# Altium schematic sheet right.SchDoc
size A1
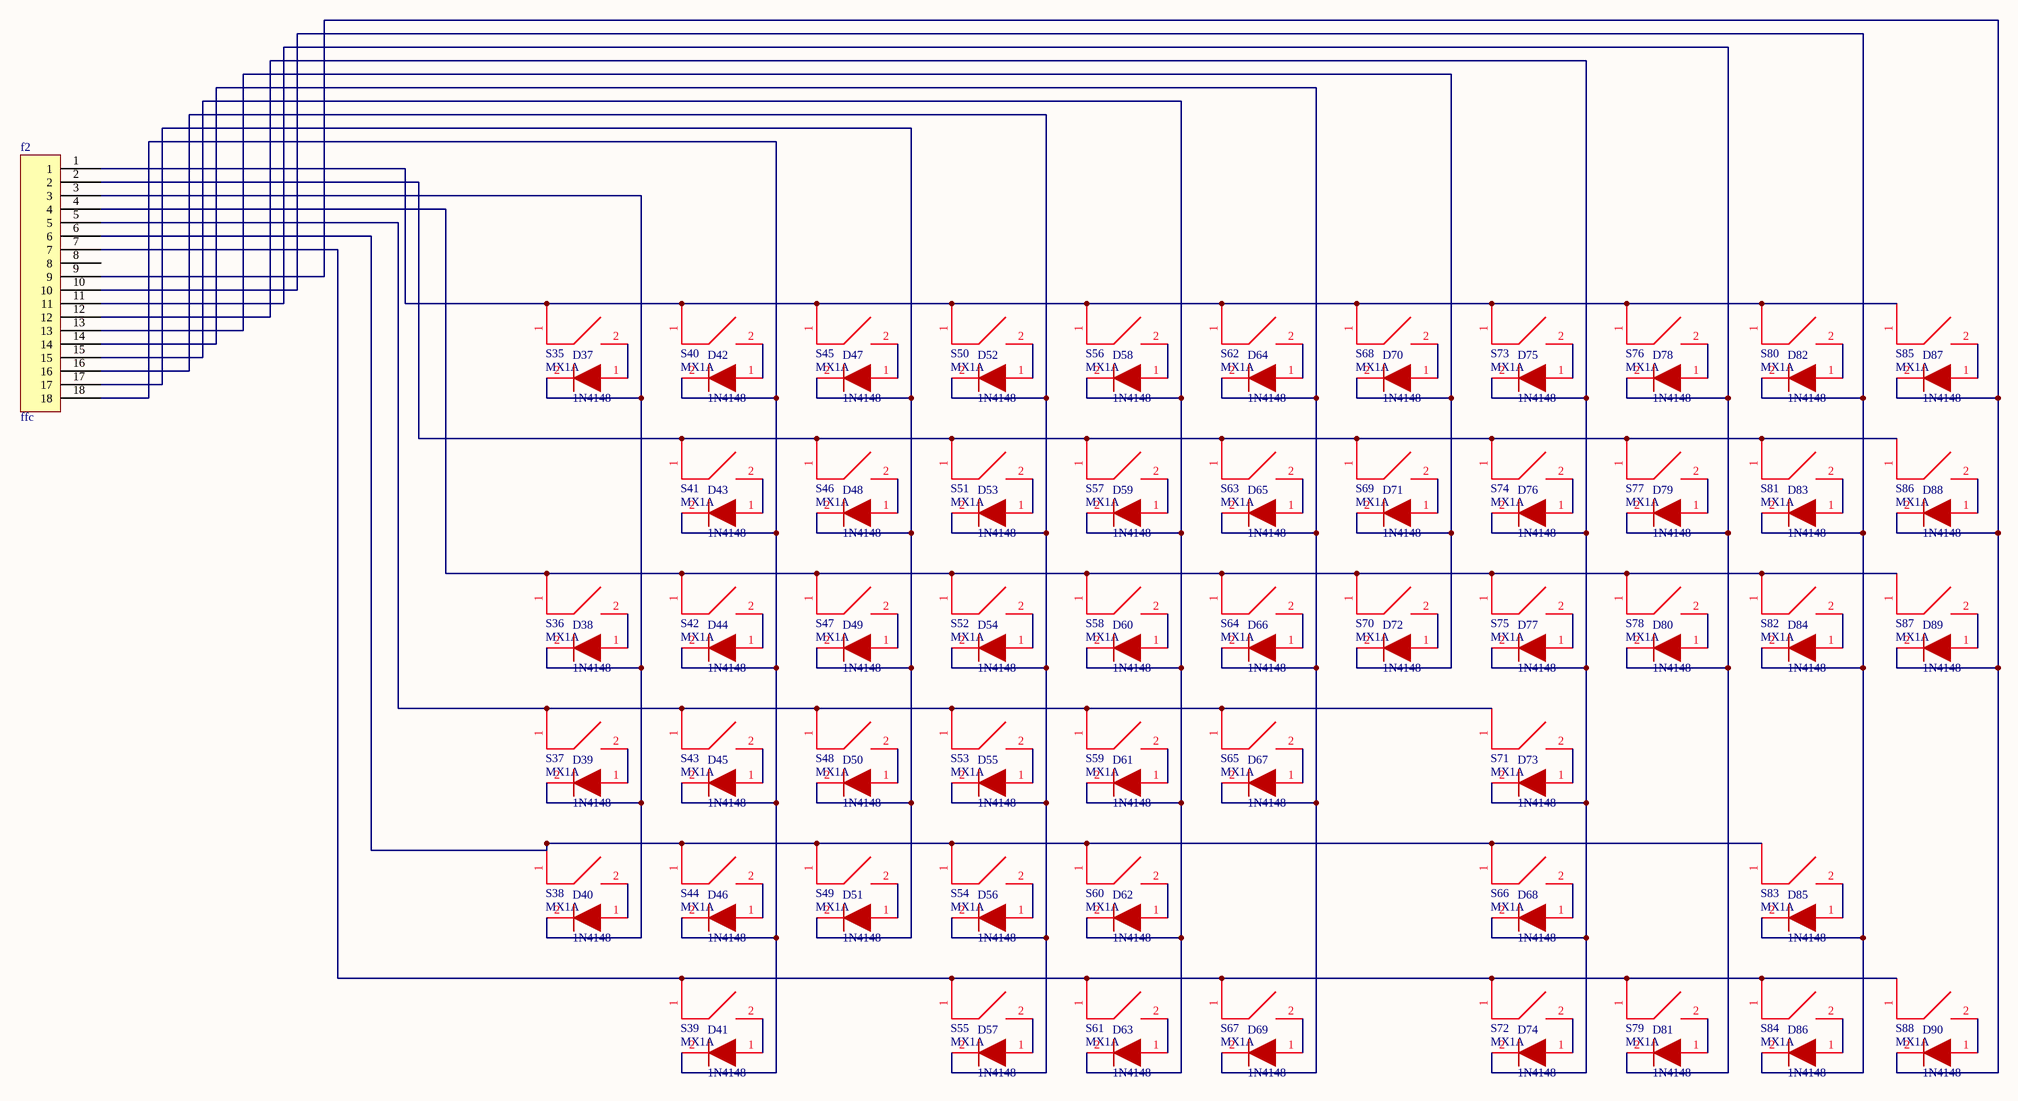
[diagram p0: right.SchDoc]

## Parts
D37  1N4148  [SOD323]
D38  1N4148  [SOD323]
D39  1N4148  [SOD323]
D40  1N4148  [SOD323]
D41  1N4148  [SOD323]
D42  1N4148  [SOD323]
D43  1N4148  [SOD323]
D44  1N4148  [SOD323]
D45  1N4148  [SOD323]
D46  1N4148  [SOD323]
D47  1N4148  [SOD323]
D48  1N4148  [SOD323]
D49  1N4148  [SOD323]
D50  1N4148  [SOD323]
D51  1N4148  [SOD323]
D52  1N4148  [SOD323]
D53  1N4148  [SOD323]
D54  1N4148  [SOD323]
D55  1N4148  [SOD323]
D56  1N4148  [SOD323]
D57  1N4148  [SOD323]
D58  1N4148  [SOD323]
D59  1N4148  [SOD323]
D60  1N4148  [SOD323]
D61  1N4148  [SOD323]
D62  1N4148  [SOD323]
D63  1N4148  [SOD323]
D64  1N4148  [SOD323]
D65  1N4148  [SOD323]
D66  1N4148  [SOD323]
D67  1N4148  [SOD323]
D68  1N4148  [SOD323]
D69  1N4148  [SOD323]
D70  1N4148  [SOD323]
D71  1N4148  [SOD323]
D72  1N4148  [SOD323]
D73  1N4148  [SOD323]
D74  1N4148  [SOD323]
D75  1N4148  [SOD323]
D76  1N4148  [SOD323]
D77  1N4148  [SOD323]
D78  1N4148  [SOD323]
D79  1N4148  [SOD323]
D80  1N4148  [SOD323]
D81  1N4148  [SOD323]
D82  1N4148  [SOD323]
D83  1N4148  [SOD323]
D84  1N4148  [SOD323]
D85  1N4148  [SOD323]
D86  1N4148  [SOD323]
D87  1N4148  [SOD323]
D88  1N4148  [SOD323]
D89  1N4148  [SOD323]
D90  1N4148  [SOD323]
f2  ffc  [FFC]
S35  MX1A  [KEY]
S36  MX1A  [KEY]
S37  MX1A  [KEY]
S38  MX1A  [KEY]
S39  MX1A  [KEY]
S40  MX1A  [KEY]
S41  MX1A  [KEY]
S42  MX1A  [KEY]
S43  MX1A  [KEY]
S44  MX1A  [KEY]
S45  MX1A  [KEY]
S46  MX1A  [KEY]
S47  MX1A  [KEY]
S48  MX1A  [KEY]
S49  MX1A  [KEY]
S50  MX1A  [KEY]
S51  MX1A  [KEY]
S52  MX1A  [KEY]
S53  MX1A  [KEY]
S54  MX1A  [KEY]
S55  MX1A  [KEY]
S56  MX1A  [KEY]
S57  MX1A  [KEY]
S58  MX1A  [KEY]
S59  MX1A  [KEY]
S60  MX1A  [KEY]
S61  MX1A  [KEY]
S62  MX1A  [KEY]
S63  MX1A  [KEY]
S64  MX1A  [KEY]
S65  MX1A  [KEY]
S66  MX1A  [KEY]
S67  MX1A  [KEY]
S68  MX1A  [KEY]
S69  MX1A  [KEY]
S70  MX1A  [KEY]
S71  MX1A  [KEY]
S72  MX1A  [KEY]
S73  MX1A  [KEY]
S74  MX1A  [KEY]
S75  MX1A  [KEY]
S76  MX1A  [KEY]
S77  MX1A  [KEY]
S78  MX1A  [KEY]
S79  MX1A  [KEY]
S80  MX1A  [KEY]
S81  MX1A  [KEY]
S82  MX1A  [KEY]
S83  MX1A  [KEY]
S84  MX1A  [KEY]
S85  MX1A  [KEY]
S86  MX1A  [KEY]
S87  MX1A  [KEY]
S88  MX1A  [KEY]

## Nets
NetD37_1: D37.1 S35.2
NetD37_2: D37.2 D38.2 D39.2 D40.2 f2.3
NetD38_1: D38.1 S36.2
NetD39_1: D39.1 S37.2
NetD40_1: D40.1 S38.2
NetD41_1: D41.1 S39.2
NetD41_2: D41.2 D42.2 D43.2 D44.2 D45.2 D46.2 f2.18
NetD42_1: D42.1 S40.2
NetD43_1: D43.1 S41.2
NetD44_1: D44.1 S42.2
NetD45_1: D45.1 S43.2
NetD46_1: D46.1 S44.2
NetD47_1: D47.1 S45.2
NetD47_2: D47.2 D48.2 D49.2 D50.2 D51.2 f2.17
NetD48_1: D48.1 S46.2
NetD49_1: D49.1 S47.2
NetD50_1: D50.1 S48.2
NetD51_1: D51.1 S49.2
NetD52_1: D52.1 S50.2
NetD52_2: D52.2 D53.2 D54.2 D55.2 D56.2 D57.2 f2.16
NetD53_1: D53.1 S51.2
NetD54_1: D54.1 S52.2
NetD55_1: D55.1 S53.2
NetD56_1: D56.1 S54.2
NetD57_1: D57.1 S55.2
NetD58_1: D58.1 S56.2
NetD58_2: D58.2 D59.2 D60.2 D61.2 D62.2 D63.2 f2.15
NetD59_1: D59.1 S57.2
NetD60_1: D60.1 S58.2
NetD61_1: D61.1 S59.2
NetD62_1: D62.1 S60.2
NetD63_1: D63.1 S61.2
NetD64_1: D64.1 S62.2
NetD64_2: D64.2 D65.2 D66.2 D67.2 D69.2 f2.14
NetD65_1: D65.1 S63.2
NetD66_1: D66.1 S64.2
NetD67_1: D67.1 S65.2
NetD68_1: D68.1 S66.2
NetD68_2: D68.2 D73.2 D74.2 D75.2 D76.2 D77.2 f2.12
NetD69_1: D69.1 S67.2
NetD70_1: D70.1 S68.2
NetD70_2: D70.2 D71.2 D72.2 f2.13
NetD71_1: D71.1 S69.2
NetD72_1: D72.1 S70.2
NetD73_1: D73.1 S71.2
NetD74_1: D74.1 S72.2
NetD75_1: D75.1 S73.2
NetD76_1: D76.1 S74.2
NetD77_1: D77.1 S75.2
NetD78_1: D78.1 S76.2
NetD78_2: D78.2 D79.2 D80.2 D81.2 f2.11
NetD79_1: D79.1 S77.2
NetD80_1: D80.1 S78.2
NetD81_1: D81.1 S79.2
NetD82_1: D82.1 S80.2
NetD82_2: D82.2 D83.2 D84.2 D85.2 D86.2 f2.10
NetD83_1: D83.1 S81.2
NetD84_1: D84.1 S82.2
NetD85_1: D85.1 S83.2
NetD86_1: D86.1 S84.2
NetD87_1: D87.1 S85.2
NetD87_2: D87.2 D88.2 D89.2 D90.2 f2.9
NetD88_1: D88.1 S86.2
NetD89_1: D89.1 S87.2
NetD90_1: D90.1 S88.2
Netf2_1: f2.1 S35.1 S40.1 S45.1 S50.1 S56.1 S62.1 S68.1 S73.1 S76.1 S80.1 S85.1
Netf2_2: f2.2 S41.1 S46.1 S51.1 S57.1 S63.1 S69.1 S74.1 S77.1 S81.1 S86.1
Netf2_4: f2.4 S36.1 S42.1 S47.1 S52.1 S58.1 S64.1 S70.1 S75.1 S78.1 S82.1 S87.1
Netf2_5: f2.5 S37.1 S43.1 S48.1 S53.1 S59.1 S65.1 S71.1
Netf2_6: f2.6 S38.1 S44.1 S49.1 S54.1 S60.1 S66.1 S83.1
Netf2_7: f2.7 S39.1 S55.1 S61.1 S67.1 S72.1 S79.1 S84.1 S88.1

Not connected (* = marked no-connect by the designer): f2 8

## Library data of the parts
D37-D90 = 1N4148: 二极管
S35-S88 = MX1A: 按键